# Altium project Open Solar Cooling Hub PCB Project - Enaccess.PrjPcb
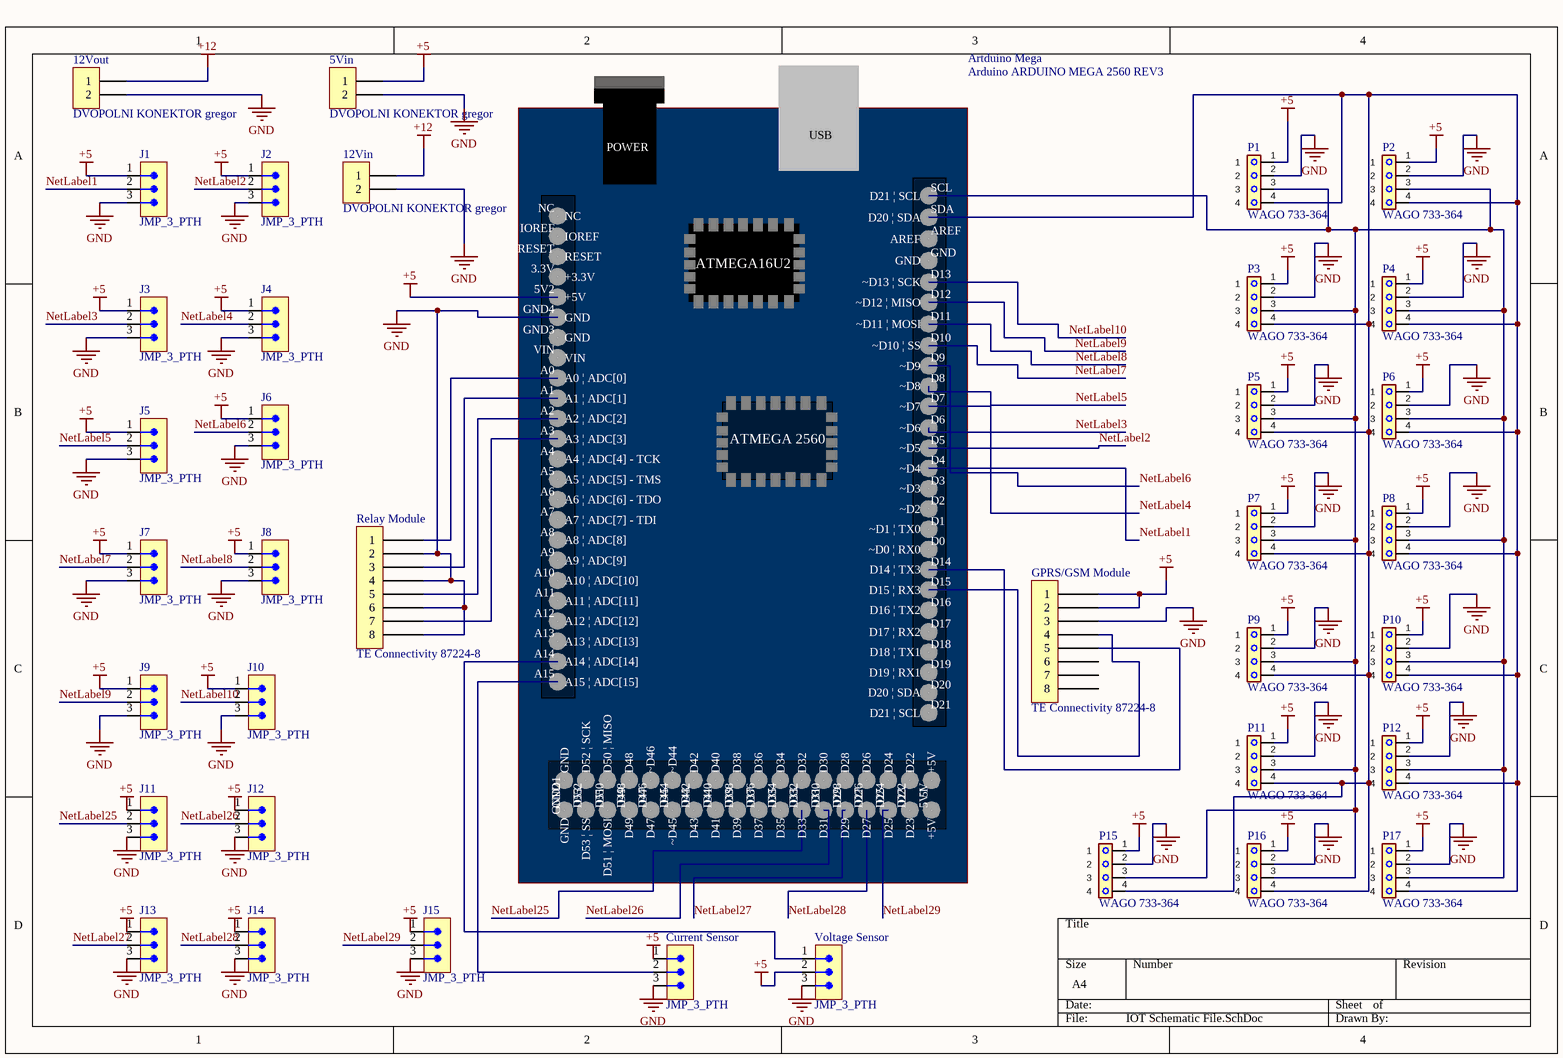
[diagram p0: IOT Schematic File.SchDoc]
1 sheet, 38 parts. Net scope: global (net labels, ports and power ports of the same name join across sheets).

## Sheet IOT Schematic File.SchDoc
size A4; SheetNumber: 1; SheetTotal: 1

### Parts
5Vin  DVOPOLNI KONEKTOR gregor  [PCB-6mcc19iryir3ivv449no-1]
12Vin  DVOPOLNI KONEKTOR gregor  [PCB-6mcc19iryir3ivv449no-1]
12Vout  DVOPOLNI KONEKTOR gregor  [PCB-6mcc19iryir3ivv449no-1]
Artduino_Mega  Arduino ARDUINO MEGA 2560 REV3  [PCBComponent_1]
Current_Sensor  JMP_3_PTH  [PCB-sk86k7dvvjlolx5r1p4b-1]
GPRS/GSM_Module  TE Connectivity 87224-8  [TE Connectivity 87224-8]
J1  JMP_3_PTH  [PCB-sk86k7dvvjlolx5r1p4b-1]
J2  JMP_3_PTH  [PCB-sk86k7dvvjlolx5r1p4b-1]
J3  JMP_3_PTH  [PCB-sk86k7dvvjlolx5r1p4b-1]
J4  JMP_3_PTH  [PCB-sk86k7dvvjlolx5r1p4b-1]
J5  JMP_3_PTH  [PCB-sk86k7dvvjlolx5r1p4b-1]
J6  JMP_3_PTH  [PCB-sk86k7dvvjlolx5r1p4b-1]
J7  JMP_3_PTH  [PCB-sk86k7dvvjlolx5r1p4b-1]
J8  JMP_3_PTH  [PCB-sk86k7dvvjlolx5r1p4b-1]
J9  JMP_3_PTH  [PCB-sk86k7dvvjlolx5r1p4b-1]
J10  JMP_3_PTH  [PCB-sk86k7dvvjlolx5r1p4b-1]
J11  JMP_3_PTH  [PCB-sk86k7dvvjlolx5r1p4b-1]
J12  JMP_3_PTH  [PCB-sk86k7dvvjlolx5r1p4b-1]
J13  JMP_3_PTH  [PCB-sk86k7dvvjlolx5r1p4b-1]
J14  JMP_3_PTH  [PCB-sk86k7dvvjlolx5r1p4b-1]
J15  JMP_3_PTH  [PCB-sk86k7dvvjlolx5r1p4b-1]
P1  WAGO 733-364  [PCB-vsf7opndapah19mhzu9o-1]
P2  WAGO 733-364  [PCB-vsf7opndapah19mhzu9o-1]
P3  WAGO 733-364  [PCB-vsf7opndapah19mhzu9o-1]
P4  WAGO 733-364  [PCB-vsf7opndapah19mhzu9o-1]
P5  WAGO 733-364  [PCB-vsf7opndapah19mhzu9o-1]
P6  WAGO 733-364  [PCB-vsf7opndapah19mhzu9o-1]
P7  WAGO 733-364  [PCB-vsf7opndapah19mhzu9o-1]
P8  WAGO 733-364  [PCB-vsf7opndapah19mhzu9o-1]
P9  WAGO 733-364  [PCB-vsf7opndapah19mhzu9o-1]
P10  WAGO 733-364  [PCB-vsf7opndapah19mhzu9o-1]
P11  WAGO 733-364  [PCB-vsf7opndapah19mhzu9o-1]
P12  WAGO 733-364  [PCB-vsf7opndapah19mhzu9o-1]
P15  WAGO 733-364  [PCB-vsf7opndapah19mhzu9o-1]
P16  WAGO 733-364  [PCB-vsf7opndapah19mhzu9o-1]
P17  WAGO 733-364  [PCB-vsf7opndapah19mhzu9o-1]
Relay_Module  TE Connectivity 87224-8  [TE Connectivity 87224-8]
Voltage_Sensor  JMP_3_PTH  [PCB-sk86k7dvvjlolx5r1p4b-1]

### Nets
+5: 5Vin.1 Artduino_Mega.5V2(+5V) Current_Sensor.1 GPRS/GSM_Module.1 GPRS/GSM_Module.2 J1.1 J2.1 J3.1 J4.1 J5.1 J6.1 J7.1 J8.1 J9.1 J10.1 J11.1 J12.1 J13.1 J14.1 J15.1 P1.1 P2.1 P3.1 P4.1 P5.1 P6.1 P7.1 P8.1 P9.1 P10.1 P11.1 P12.1 P15.1 P16.1 P17.1 Voltage_Sensor.2
+12: 12Vin.1 12Vout.1
GND: 5Vin.2 12Vin.2 12Vout.2 Artduino_Mega.GND4(GND) Current_Sensor.3 GPRS/GSM_Module.3 J1.3 J2.3 J3.3 J4.3 J5.3 J6.3 J7.3 J8.3 J9.3 J10.3 J11.3 J12.3 J13.3 J14.3 J15.3 P1.2 P2.2 P3.2 P4.2 P5.2 P6.2 P7.2 P8.2 P9.2 P10.2 P11.2 P12.2 P15.2 P16.2 P17.2 Relay_Module.2 Relay_Module.4 Relay_Module.6 Relay_Module.8 Voltage_Sensor.3
NetLabel1: Artduino_Mega.D4(~D4) J1.2
NetLabel2: Artduino_Mega.D5(~D5) J2.2
NetLabel3: Artduino_Mega.D6(~D6) J3.2
NetLabel4: Artduino_Mega.D7(~D7) J4.2
NetLabel5: Artduino_Mega.D8(~D8) J5.2
NetLabel6: Artduino_Mega.D9(~D9) J6.2
NetLabel7: Artduino_Mega.D10(~D10_|_SS) J7.2
NetLabel8: Artduino_Mega.D11(~D11_|_MOSI) J8.2
NetLabel9: Artduino_Mega.D12(~D12_|_MISO) J9.2
NetLabel10: Artduino_Mega.D13(~D13_|_SCK) J10.2
NetLabel25: Artduino_Mega.D33 J11.2
NetLabel26: Artduino_Mega.D31 J12.2
NetLabel27: Artduino_Mega.D29 J13.2
NetLabel28: Artduino_Mega.D27 J14.2
NetLabel29: Artduino_Mega.D25 J15.2
NetArtduino_Mega_A0: Artduino_Mega.A0(A0_|_ADC[0]) Relay_Module.1
NetArtduino_Mega_A1: Artduino_Mega.A1(A1_|_ADC[1]) Relay_Module.3
NetArtduino_Mega_A2: Artduino_Mega.A2(A2_|_ADC[2]) Relay_Module.5
NetArtduino_Mega_A3: Artduino_Mega.A3(A3_|_ADC[3]) Relay_Module.7
NetArtduino_Mega_A14: Artduino_Mega.A14(A14_|_ADC[14]) Voltage_Sensor.1
NetArtduino_Mega_A15: Artduino_Mega.A15(A15_|_ADC[15]) Current_Sensor.2
NetArtduino_Mega_D14: Artduino_Mega.D14(D14_|_TX3) GPRS/GSM_Module.5
NetArtduino_Mega_D15: Artduino_Mega.D15(D15_|_RX3) GPRS/GSM_Module.4
NetArtduino_Mega_SCL: Artduino_Mega.SCL(D21_|_SCL) P1.3 P2.3 P3.3 P4.3 P5.3 P6.3 P7.3 P8.3 P9.3 P10.3 P11.3 P12.3 P15.3 P16.3 P17.3
NetArtduino_Mega_SDA: Artduino_Mega.SDA(D20_|_SDA) P1.4 P2.4 P3.4 P4.4 P5.4 P6.4 P7.4 P8.4 P9.4 P10.4 P11.4 P12.4 P15.4 P16.4 P17.4

Not connected (* = marked no-connect by the designer): Artduino_Mega 3.3V(+3.3V) 5V(+5V) 5V1(+5V) A4(A4_|_ADC[4]_-_TCK) A5(A5_|_ADC[5]_-_TMS) A6(A6_|_ADC[6]_-_TDO) A7(A7_|_ADC[7]_-_TDI) A8(A8_|_ADC[8]) A9(A9_|_ADC[9]) A10(A10_|_ADC[10]) A11(A11_|_ADC[11]) A12(A12_|_ADC[12]) A13(A13_|_ADC[13]) AREF D0(~D0_|_RX0) D1(~D1_|_TX0) D2(~D2) D3(~D3) D16(D16_|_TX2) D17(D17_|_RX2) D18(D18_|_TX1) D19(D19_|_RX1) D20(D20_|_SDA) D21(D21_|_SCL) D22 D23 D24 D26 D28 D30 D32 D34 D35 D36 D37 D38 D39 D40 D41 D42 D43 D44(~D44) D45(~D45) D46(~D46) D47 D48 D49 D50(D50_|_MISO) D51(D51_|_MOSI) D52(D52_|_SCK) D53(D53_|_SS) GND GND1(GND) GND2(GND) GND3(GND) IOREF NC RESET VIN; GPRS/GSM_Module 6 7 8

### Notes on the sheet
- (in symbol CMP-0ba5c1fab996d462-8) USB; POWER; ATMEGA16U2; ATMEGA 2560

### Library data of the parts
5Vin 12Vin 12Vout = CMP-dced15fdaf45032a-3: Terminal block; PCB; Header; Male Pins; Shrouded (4 Side); 2 position; 16A; 400V; Solder; Manufacturer Part Number: 1923869; Lead-Free Status: Lead Free; RoHS: Compliant; Housing Color: Green; Mounting Style: Through Hole, Solder; Contact Plating: Tin, Silver; Gender: Male; OctopartID: dced15fdaf45032a; Octopart URL: https://octopart.com/1923869-phoenix+contact-1726158; Flammability Rating: UL 94 V-0
Artduino_Mega = CMP-0ba5c1fab996d462-8: Arduino Mega 2560 REV3; Footprint: PCB-frjzqoslz4qb2kr6klsy-1; OctopartID: 2569eda3bb96faae; Octopart URL: https://octopart.com/arduino+mega+2560+rev3-arduino-29408153; Manufacturer Part Number: ARDUINO MEGA 2560 REV3
Current_Sensor J1-J15 Voltage_Sensor = CMP-683aa16207d4b7fd-26: Board-To-Board Connector, M20 Series, Through Hole, Header, 9, 2.54 mm, Gold Plated Contacts; Manufacturer Part Number: M20-9990345; Pin Pitch: 2.54 mm; Voltage Rating (AC): 750 V; Insulation Resistance: 10.0 GΩ; Gender: Female; Contact Resistance: 25.0 mΩ; Current Rating: 3.00 A; Number of Contacts: 9; Number of Mating Cycles: 300; Contact Plating: Gold; Contact Material: Phosphor Bronze; REACH SVHC Compliance: No SVHC; Operating Temperature: -40.0 °C (min); Octopart URL: https://octopart.com/m20-9990345-harwin-5393032; RoHS: Compliant; Mounting Style: Through Hole, Vertical
GPRS/GSM_Module Relay_Module = CMP-2e5fe59d1023f198-2: Board Connector, 8 Contact(s), 1 Row(s), Male, Straight, Solder Terminal, Black Insulator; Mounting Angle: 180 °; ELV Compliant: Compliant; Lead-Free Status: Lead Free; Number of Positions: 8; Pin Pitch: 2.54 mm; Packaging: Box; Manufacturer Part Number: 87224-8; Operating Temperature: -65.0 °C to 105 °C; OctopartID: 2e5fe59d1023f198; Flammability Rating: UL 94 V-0; Octopart Url: https://octopart.com/87224-8-te+connectivity-46668570; Housing Color: Black; Housing Material: Thermoplastic; Color: Black; Mounting Style: PCB; Contact Material: Copper Alloy; Contact Plating: Gold Flash, Gold, Gold Flash over Nickel; RoHS: Compliant; Number of Rows: 1; Orientation: Vertical; Lifecycle Status: Active; Size-Length: 19.9 mm; Gender: Male; Number of Contacts: 8
P1-P12 P15-P17 = CMP-d8d411d0b44d0713-2: Wire-To-Board Connector, Right Angle, Through Hole, Plug, 4, 2.5 mm, Tin Plated Contacts; Number of Contacts: 4; Gender: Male; Lead-Free Status: Lead Free; Pin Pitch: 2.50 mm; Housing Color: Gray; Contact Material: Steel; Contact Plating: Tin; Manufacturer Part Number: 733-364; OctopartID: d8d411d0b44d0713; RoHS: Compliant; Flammability Rating: UL 94 V-0; Octopart URL: http://octopart.com/733-364-wago-936447